# EAGLE design Lower Board (EAGLE 9.6.2)
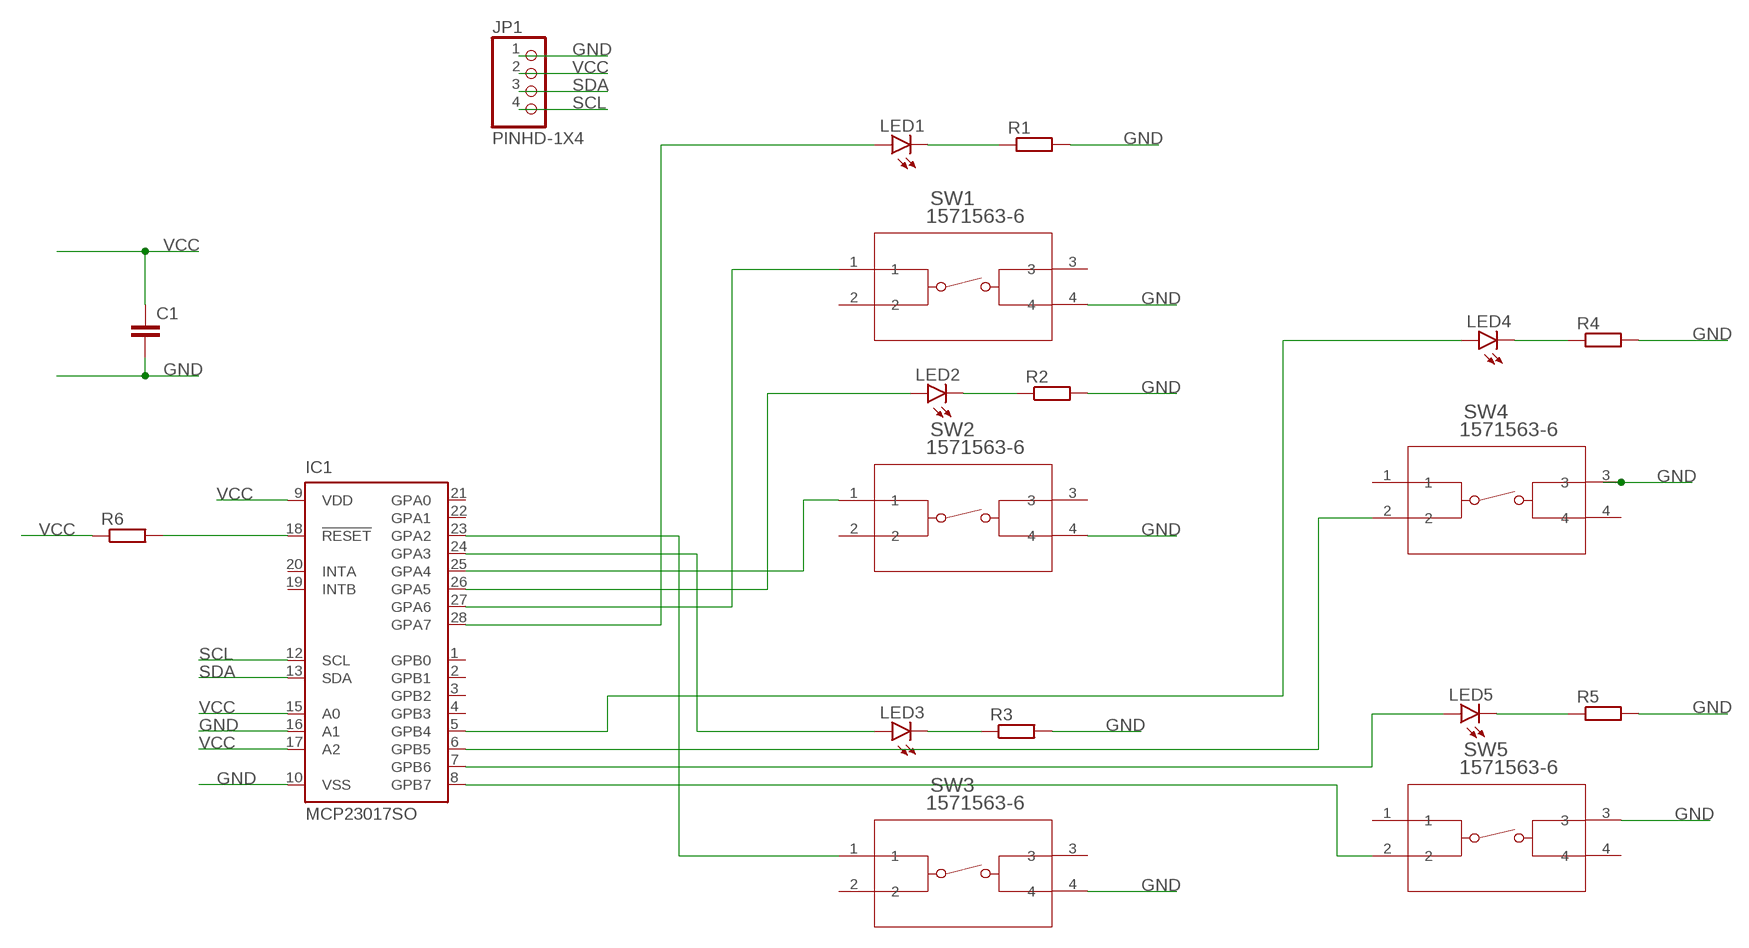
[diagram p0: schematic, sheet 1]

## Parts
C1  C-EU025-025X050  [C025-025X050]
IC1  MCP23017SO  [SO28W]
JP1  PINHD-1X4  [1X04]
LED1  LEDCHIP-LED0805  [CHIP-LED0805]
LED2  LEDCHIP-LED0805  [CHIP-LED0805]
LED3  LEDCHIP-LED0805  [CHIP-LED0805]
LED4  LEDCHIP-LED0805  [CHIP-LED0805]
LED5  LEDCHIP-LED0805  [CHIP-LED0805]
R1  R-EU_R0805  [R0805]
R2  R-EU_R0805  [R0805]
R3  R-EU_R0805  [R0805]
R4  R-EU_R0805  [R0805]
R5  R-EU_R0805  [R0805]
R6  R-EU_R0805  [R0805]
SW1  1571563-6  [SW4_1437565-E]
SW2  1571563-6  [SW4_1437565-E]
SW3  1571563-6  [SW4_1437565-E]
SW4  1571563-6  [SW4_1437565-E]
SW5  1571563-6  [SW4_1437565-E]

## Nets
GND: C1.2 IC1.10(VSS) IC1.16(A1) JP1.1 R1.2 R2.2 R3.2 R4.2 R5.2 SW1.4 SW2.4 SW3.4 SW4.3 SW5.3
N$1: LED1.C R1.1
N$2: LED2.C R2.1
N$3: LED3.C R3.1
N$4: LED5.C R5.1
N$5: LED4.C R4.1
N$6: IC1.28(GPA7) LED1.A
N$7: IC1.27(GPA6) SW1.1
N$8: IC1.26(GPA5) LED2.A
N$9: IC1.25(GPA4) SW2.1
N$10: IC1.24(GPA3) LED3.A
N$11: IC1.23(GPA2) SW3.1
N$12: IC1.8(GPB7) SW5.2
N$13: IC1.18(!RESET) R6.2
N$14: IC1.7(GPB6) LED5.A
N$15: IC1.6(GPB5) SW4.2
N$16: IC1.5(GPB4) LED4.A
SCL: IC1.12(SCL) JP1.4
SDA: IC1.13(SDA) JP1.3
VCC: C1.1 IC1.9(VDD) IC1.15(A0) IC1.17(A2) JP1.2 R6.1
Unconnected: IC1.1(GPB0) IC1.2(GPB1) IC1.3(GPB2) IC1.4(GPB3) IC1.19(INTB) IC1.20(INTA) IC1.21(GPA0) IC1.22(GPA1) SW1.2 SW1.3 SW2.2 SW2.3 SW3.2 SW3.3 SW4.1 SW4.4 SW5.1 SW5.4

## Library data of the parts
C1 = rcl:C-EU: CAPACITOR, European symbol; SPICEPREFIX: C
IC1 = microchip:MCP23017: http://ww1.microchip.com/downloads/en/DeviceDoc/21952a.pdf Source: http://ww1.microchip.com/downloads/en/DeviceDoc/21952a.pdf; MF: MICROCHIP; MPN: MCP23017-E/SO; OC_FARNELL: 1332087; OC_NEWARK: 31K2958
JP1 = Connector:PINHD-1X4: PIN HEADER; CATEGORY: CONNECTOR; SUB-CATEGORY: PIN-HEADER
LED1-LED5 = led:LED: LED OSRAM: - CHIPLED LG R971, LG N971, LY N971, LG Q971, LY Q971, LO R971, LY R971 LH N974, LH R974 LS Q976, LO Q976, LY Q976 LO Q996 - Hyper CHIPLED LW Q18S LB Q993, LB Q99A, LB R99A - SideLED LS A670, LO A670, LY A670, LG A670, LP A670 LB A673, LV A673, LT A673, LW A673 LH A674 LY A675 LS A676, LA A676, LO A676, LY A676, LW A676 LS A679, LY A679, LG A679 - Hyper Micro SIDELED® LS Y876, LA Y876, LO Y876, LY Y876 LT Y87S - SmartLED LW L88C, LW L88S LB L89C, LB L89S, LG L890 LS L89K, LO L89K, LY L89K LS L896, LA L896, LO L896, LY L896 - TOPLED LS T670, LO T670, LY T670, LG T670, LP T670 LSG T670, LSP T670, LSY T670, LOP T670, LYG T670 LG T671, LOG T671, LSG T671 LB T673, LV T673, LT T673, LW T673 LH T674 LS T676, LA T676, LO T676, LY T676, LB T676, LH T676, LSB T676, LW T676 LB T67C, LV T67C, LT T67C, LS T67K, LO T67K, LY T67K, LW E67C LS E67B, LA E67B, LO E67B, LY E67B, LB E67C, LV E67C, LT E67C LW T67C LS T679, LY T679, LG T679 LS T770, LO T770, LY T770, LG T770, LP T770 LB T773, LV T773, LT T773, LW T773 LH T774 LS E675, LA E675, LY E675, LS T675 LS T776, LA T776, LO T776, LY T776, LB T776 LHGB T686 LT T68C, LB T68C - Hyper Mini TOPLED® LB M676 - Mini TOPLED Santana® LG M470 LS M47K, LO M47K, LY M47K Source: http://www.osram.convergy.de LUXEON: - LUMILED® LXK2-PW12-R00, LXK2-PW12-S00, LXK2-PW14-U00, LXK2-PW14-V00 LXK2-PM12-R00, LXK2-PM12-S00, LXK2-PM14-U00 LXK2-PE12-Q00, LXK2-PE12-R00, LXK2-PE12-S00, LXK2-PE14-T00, LXK2-PE14-U00 LXK2-PB12-K00, LXK2-PB12-L00, LXK2-PB12-M00, LXK2-PB14-N00, LXK2-PB14-P00, LXK2-PB14-Q00 LXK2-PR12-L00, LXK2-PR12-M00, LXK2-PR14-Q00, LXK2-PR14-R00 LXK2-PD12-Q00, LXK2-PD12-R00, LXK2-PD12-S00 LXK2-PH12-R00, LXK2-PH12-S00 LXK2-PL12-P00, LXK2-PL12-Q00, LXK2-PL12-R00 Source: www.luxeon.com KINGBRIGHT: KA-3528ASYC Source: www.kingbright.com
R1-R6 = rcl:R-EU_: RESISTOR, European symbol; SPICEPREFIX: R
SW1-SW5 = Switches:1571563-6; BUILT_BY: EMA_UL_Team; CATEGORY: Tactile Switches; COPYRIGHT: Copyright (C) 2016 Accelerated Designs. All rights reserved; DESCRIPTION: FSM14JSMAATR=TACT,SMT,T&R; MANUFACTURER_PART_NUMBER: 1571563-6; PART_STATUS: active; SERIES: Alcoswitch FSMJSMA; VENDOR: TE Connectivity

## Board
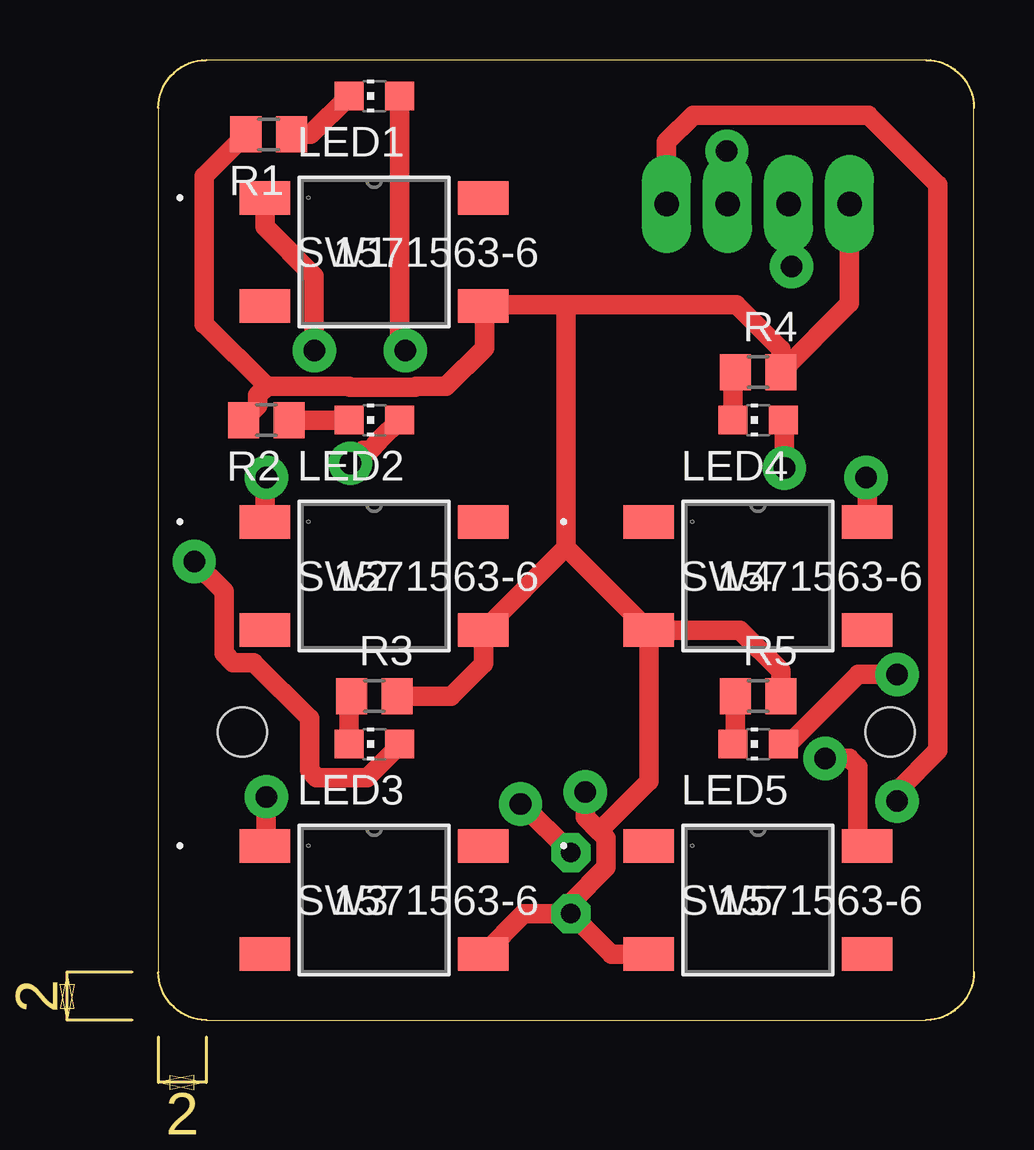
[diagram p1: board, top side]
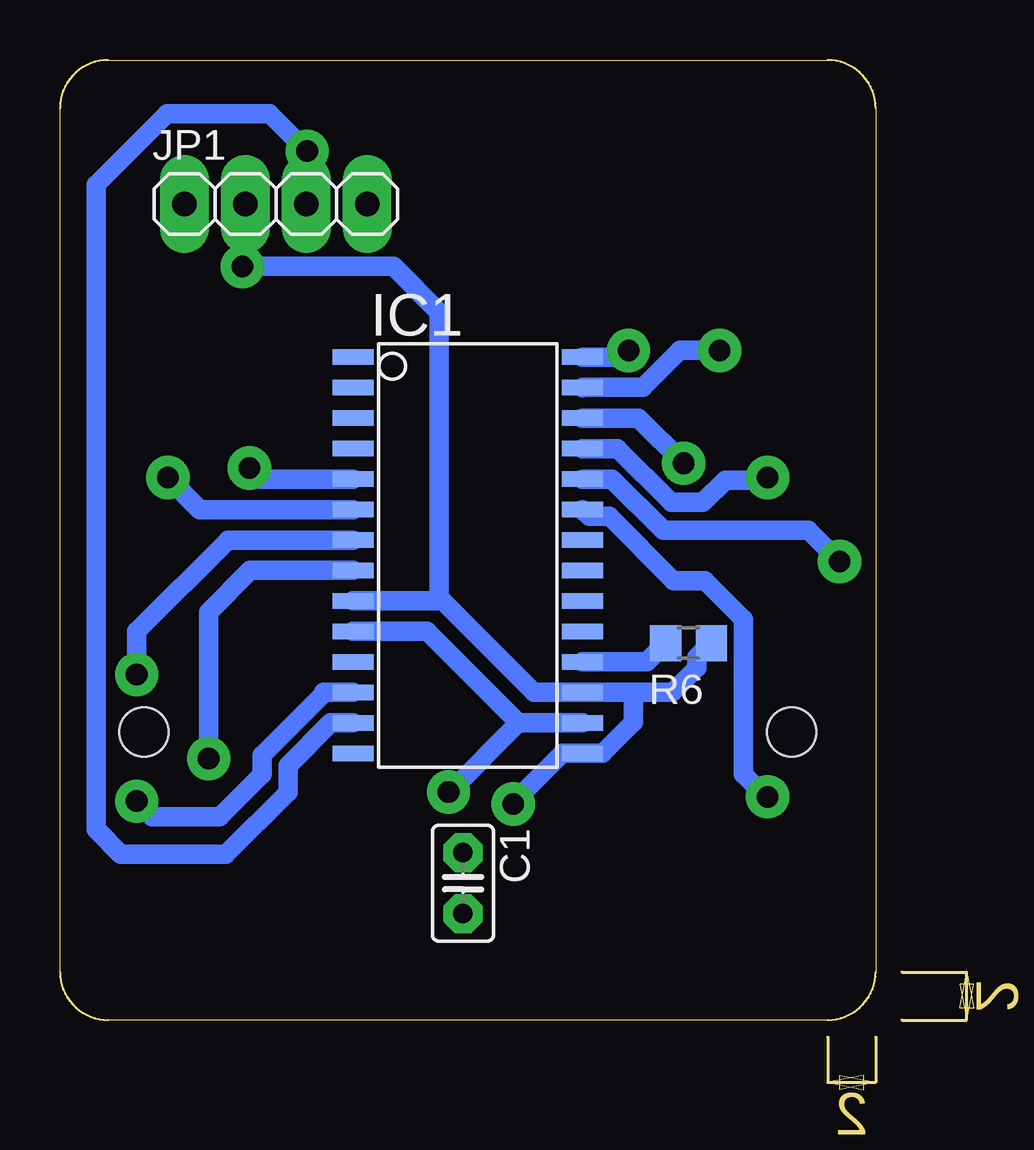
[diagram p2: board, bottom side, seen from below]

Size 34 x 40 mm. Coordinates in mm from the lower left corner, seen from the top.
Outline: 2,0 4,0 32,0 arc90 34,2 34,38 arc90 32,40 2,40 arc90 0,38 0,2 arc90 2,0
Copper layers (1*16): Top 0.035mm / dielectric 1.5mm / Bottom 0.035mm
Design rules "swidzi_milling_3018_smd_test *": minimum track width 20mil, minimum drill 0.8mm, track to track 0.25mm, track to pad 0.25mm, pad to pad 0.25mm, via to via 6mil, smd to smd 6mil, copper to edge 15mil, drill to drill 6mil, minimum pad ring 10mil, minimum via ring 10mil, stop-mask expansion 4mil, vias tented up to drill 0mil, thermal gap 10mil
Holes 2.05 mm at 3.5,12 30.5,12

### Footprints (pad centres in the part's own frame; a part is rotated, then mirrored left to right if it is on the bottom)
C025-025X050 = drill 0.813 octagon: 1 -1.27,0; 2 1.27,0
SO28W = smd 0.65 x 1.7: 1 -7.62,-4.78; 2 -6.35,-4.78; 3 -5.08,-4.78; 4 -3.81,-4.78; 5 -2.54,-4.78; 6 -1.27,-4.78; 7 0,-4.78; 8 1.27,-4.78; 9 2.54,-4.78; 10 3.81,-4.78; 11 5.08,-4.78; 12 6.35,-4.78; 13 7.62,-4.78; 14 8.89,-4.78; 15 8.89,4.78; 16 7.62,4.78; 17 6.35,4.78; 18 5.08,4.78; 19 3.81,4.78; 20 2.54,4.78; 21 1.27,4.78; 22 0,4.78; 23 -1.27,4.78; 24 -2.54,4.78; 25 -3.81,4.78; 26 -5.08,4.78; 27 -6.35,4.78; 28 -7.62,4.78
1X04 = drill 1.016 long: 1 -3.81,0; 2 -1.27,0; 3 1.27,0; 4 3.81,0
CHIP-LED0805 = smd 1.2 x 1.2: A 0,-1.05; C 0,1.05
R0805 = smd 1.3 x 1.5: 1 -0.95,0; 2 0.95,0
SW4_1437565-E = smd 2.108 x 1.397: 1 -4.55,2.25; 2 4.55,2.25; 3 -4.55,-2.25; 4 4.55,-2.25

### Placement (x,y rotation side)
C1  17.2,5.7 270 bottom
IC1  17,20 270 bottom
JP1  25,34 0 bottom
LED1  9,38.5 90 top
LED2  9,25 90 top
LED3  9,11.5 90 top
LED4  25,25 90 top
LED5  25,11.5 90 top
R1  4.6,36.9 180 top
R2  4.5,25 180 top
R3  9,13.5 0 top
R4  25,27 0 top
R5  25,13.5 0 top
R6  7.8,15.7 180 bottom
SW1  9,32 0 top
SW2  9,18.5 0 top
SW3  9,5 0 top
SW4  25,18.5 0 top
SW5  25,5 0 top

### Tracks (layer width: path | path; a pad name or v marks a point on that pad's centre or on a via)
GND  (via drill 0.9)
  Top 0.813: C1.2 17.2,4.89 18.67,6.36 18.67,7.58 18.37,7.87 | 18.37,7.87 17.8,8.45 v17.8,9.5 | JP1.1 28.81,29.86 R4.2 25.95,27.95 24.1,29.8 17.1,29.8 | 17.1,29.8 13.6,29.8 | 13.6,29.8 SW1.4 | R2.2 4.14,25.59 4.14,26.02 4.53,26.41 | 4.53,26.41 7.95,26.41 7.99,26.37 10.71,26.37 10.74,26.4 12,26.4 13.6,28 13.6,29.8 | 4.53,26.41 1.94,29 1.9,29 1.9,35.15 R1.2 | 17,19.7 SW2.4 13.55,14.85 12.2,13.5 R3.2 | 17.1,29.8 17,29.7 17,19.7 | SW4.3 17,19.7 | SW3.4 15.23,4.43 C1.2 | SW5.3 18.88,2.75 C1.2 | SW4.3 20.45,9.95 18.37,7.87 | SW4.3 24.25,16.25 25.95,14.55 R5.2
  Bottom 0.813: IC1.10 18.69,16.19 14.88,12.38 | 14.88,12.38 IC1.16 | v17.8,9.5 17.76,9.5 14.88,12.38
N$1
  Top 0.813: LED1.C 6.35,36.9 R1.1
N$2
  Top 0.813: LED2.C R2.1
N$3
  Top 0.813: LED3.C 7.95,13.4 R3.1
N$4
  Top 0.813: R5.1 24.05,11.6 LED5.C
N$5
  Top 0.813: LED4.C 23.95,26.9 R4.1
N$6  (via drill 0.9)
  Top 0.813: LED1.A 10.05,28.35 10.4,28 v10.3,27.9
  Bottom 0.813: v10.3,27.9 10.58,27.62 IC1.28
N$7  (via drill 0.9)
  Top 0.813: v6.5,27.9 6.5,31 4.45,33.05 SW1.1
  Bottom 0.813: v6.5,27.9 8.15,27.9 9.69,26.37 12.2,26.37 IC1.27
N$8  (via drill 0.9)
  Top 0.813: v8,23.2 8.54,23.74 8.82,23.74 9.21,24.13 9.21,24.16 LED2.A
  Bottom 0.813: IC1.26 9.88,25.08 v8,23.2
N$9  (via drill 0.9)
  Top 0.813: v4.5,22.6 4.45,22.55 SW2.1
  Bottom 0.813: IC1.25 10.76,23.81 8.51,21.57 7.19,21.57 6.25,22.5 4.6,22.5 v4.5,22.6
N$10  (via drill 0.9)
  Top 0.813: v1.5,19.1 2.74,17.86 2.74,15.28 3.12,14.89 3.97,14.89 6.3,12.56 6.3,10.4 6.6,10.1 8.7,10.1 10.05,11.45 LED3.A
  Bottom 0.813: IC1.24 10.99,22.54 8.85,20.4 2.8,20.4 v1.5,19.1
N$11  (via drill 0.9)
  Top 0.813: v4.5,9.3 4.5,7.3 SW3.1
  Bottom 0.813: IC1.23 11.93,20.98 11.1,20.98 8.42,18.3 7.12,18.3 5.51,16.69 5.51,10.25 4.56,9.3 v4.5,9.3
N$12  (via drill 0.9)
  Top 0.813: v27.8,10.9 28.8,10.9 29.15,10.55 29.15,7.65 SW5.2
  Bottom 0.813: IC1.8 26.07,18.73 27.8,17 v27.8,10.9
N$13
  Bottom 0.813: IC1.18 9.53,14.92 R6.2
N$14  (via drill 0.9)
  Top 0.813: LED5.A 26.24,11.5 26.24,11.49 26.27,11.49 29.18,14.4 v30.8,14.4
  Bottom 0.813: v30.8,14.4 30.8,16.2 27,20 IC1.7
N$15  (via drill 0.9)
  Top 0.813: SW4.2 29.55,22.55 v29.5,22.6
  Bottom 0.813: v29.5,22.6 28.17,21.27 IC1.6
N$16  (via drill 0.9)
  Top 0.813: v26.1,23 26.1,24.95 LED4.A
  Bottom 0.813: IC1.5 25.64,22.54 v26.1,23
SCL  (via drill 0.9)
  Top 0.813: JP1.4 21.19,36.59 22.3,37.7 29.6,37.7 32.5,34.8 32.5,11.24 30.8,9.54 v30.8,9.12
  Bottom 0.813: IC1.12 23,13.65 23,13.6 25.56,11.04 25.56,10.24 27.33,8.47 30.15,8.47 v30.8,9.12
SDA  (via drill 0.9)
  Top 0.813: JP1.3 23.73,36.17 v23.7,36.2
  Bottom 0.813: v23.7,36.2 25.26,37.76 29.54,37.76 32.5,34.8 32.5,7.94 31.46,6.9 27.1,6.9 24.5,9.5 24.5,10.6 22.72,12.38 IC1.13
VCC  (via drill 0.9)
  Top 0.813: v15.1,9 15.17,9 C1.1 | JP1.2 26.4,33.87 v26.4,31.4
  Bottom 0.813: 18.06,17.46 IC1.9 | 18.06,17.46 14.25,13.65 IC1.17 10.1,13.65 | R6.1 7.44,15.11 7.44,14.68 8.47,13.65 10.1,13.65 | 10.1,13.65 10.1,12.4 11.38,11.12 IC1.15 13.06,11.11 15.1,9.07 v15.1,9 | 18.06,17.46 18.2,17.6 18.2,29.5 20.1,31.4 v26.4,31.4